# Altium schematic sheet Sheet1.SchDoc
size A4; SheetNumber: 1; SheetTotal: 1
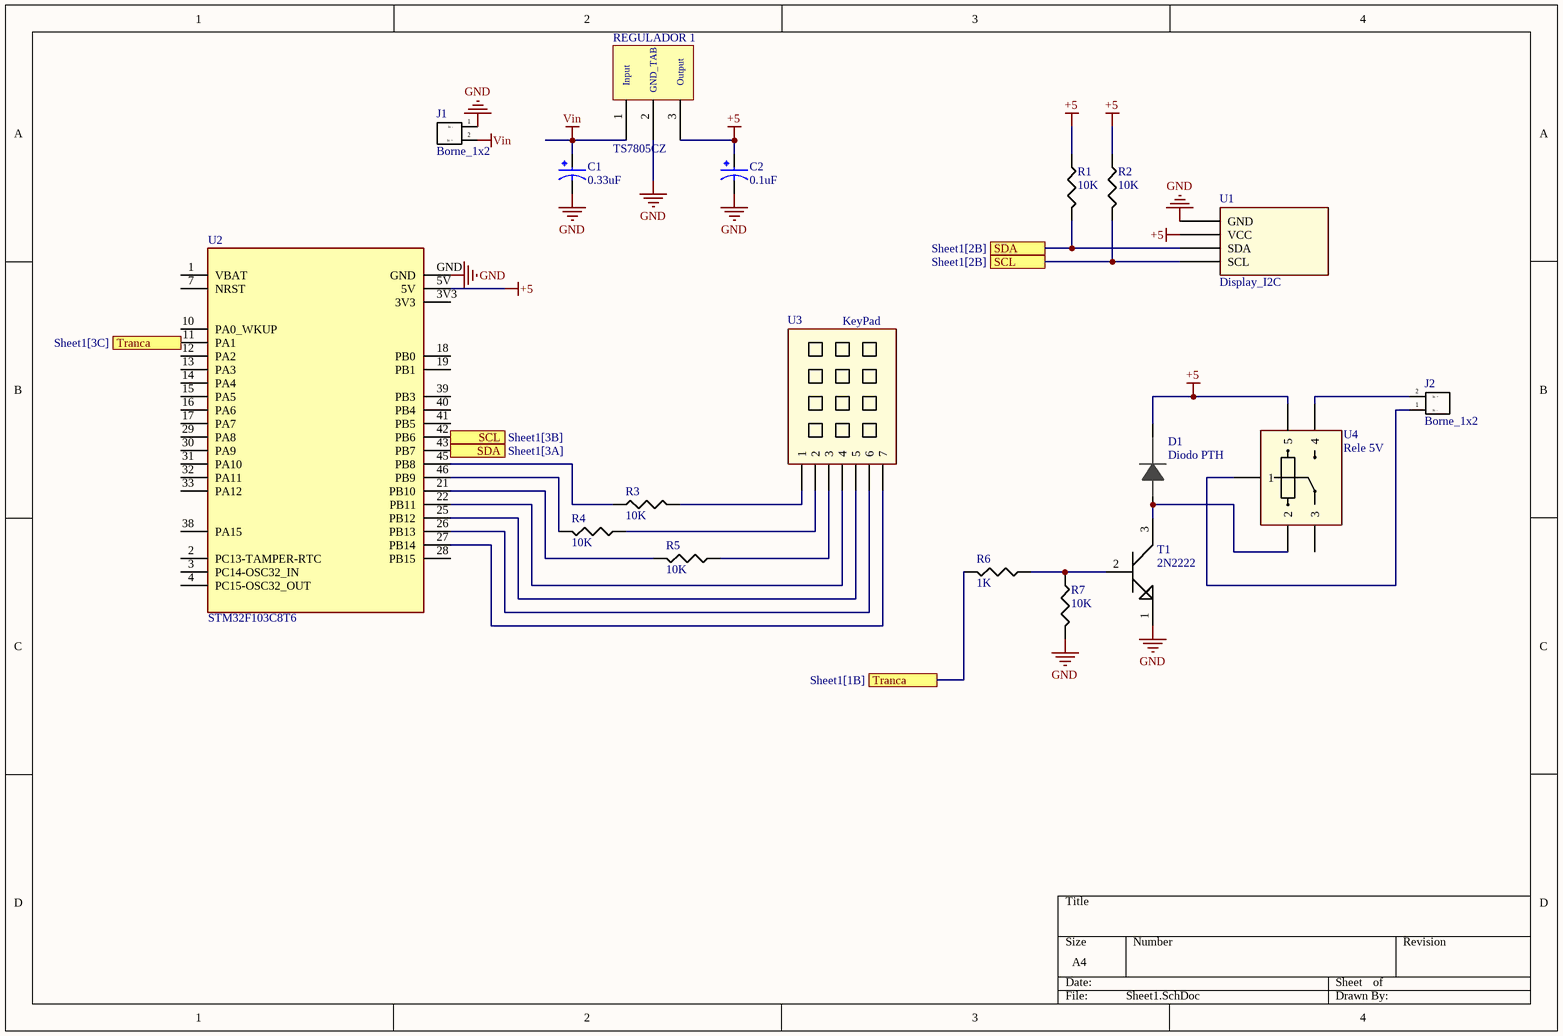
[diagram p0: Sheet1.SchDoc]

## Parts
C1  0.33uF  [CAPPRD250W45D630H700]
C2  0.1uF  [CAPPRD250W45D630H700]
D1  Diodo PTH  [DIODO]
J1  Borne_1x2  [Borne1x2]
J2  Borne_1x2  [Borne1x2]
R1  10K  [R_PTH]
R2  10K  [R_PTH]
R3  10K  [R_PTH]
R4  10K  [R_PTH]
R5  10K  [R_PTH]
R6  1K  [R_PTH]
R7  10K  [R_PTH]
REGULADOR_1  TS7805CZ  [TS7805CZ-TO220]
T1  2N2222  [2N2222]
U1  Display_I2C  [LCD_I2C]
U2  STM32F103C8T6  [STM32]
U3  KeyPad  [KeyPad]
U4  Rele 5V  [Rele]

## Ports
SCL (see Sheet1[2B]), SCL (see Sheet1[3B]), SDA (see Sheet1[2B]), SDA (see Sheet1[3A]), Tranca (see Sheet1[1B]), Tranca (see Sheet1[3C])

## Nets
+5: C2.P D1.1 R1.1 R2.1 REGULADOR_1.3 U1.2(VCC) U2.5V U4.5
GND: C1.N C2.N J1.1(In_-) R7.2 REGULADOR_1.2 T1.1 U1.1(GND) U2.GND
Vin: C1.P J1.2(In_+) REGULADOR_1.1
SCL: R2.2 U1.4(SCL) U2.42(PB6) ; port SCL
SDA: R1.2 U1.3(SDA) U2.43(PB7) ; port SDA
Tranca: R6.2 U2.11(PA1) ; port Tranca
NetD1_2: D1.2 T1.3 U4.2
NetJ2_1: J2.1(In_-) U4.1
NetJ2_2: J2.2(In_+) U4.4
NetR3_1: R3.1 U2.45(PB8)
NetR3_2: R3.2 U3.1
NetR4_1: R4.1 U3.2
NetR4_2: R4.2 U2.46(PB9)
NetR5_1: R5.1 U3.3
NetR5_2: R5.2 U2.21(PB10)
NetR6_1: R6.1 R7.1 T1.2
NetU2_22: U2.22(PB11) U3.4
NetU2_25: U2.25(PB12) U3.5
NetU2_26: U2.26(PB13) U3.6
NetU2_27: U2.27(PB14) U3.7

Not connected (* = marked no-connect by the designer): U2 1(VBAT) 2(PC13-TAMPER-RTC) 3(PC14-OSC32_IN) 3V3 4(PC15-OSC32_OUT) 7(NRST) 10(PA0_WKUP) 12(PA2) 13(PA3) 14(PA4) 15(PA5) 16(PA6) 17(PA7) 18(PB0) 19(PB1) 28(PB15) 29(PA8) 30(PA9) 31(PA10) 32(PA11) 33(PA12) 38(PA15) 39(PB3) 40(PB4) 41(PB5); U4 3

## Notes on the sheet
- (in symbol TS7805CZ) Input; Output; GND_TAB

## Library data of the parts
C1 C2 = EEAGA1A680: Aluminium Electrolytic Capacitor, Ga Series, 68 - F, - 20%, 10 V, 6.3 Mm, Radial Leaded; MF: Panasonic; Value: *; Price: None; Package: RADIAL-2 Panasonic; Availability: In Stock; Check_prices: https://www.snapeda.com/parts/EEAGA1A680/Panasonic/view-part/2776310/?ref=eda; MP: EEAGA1A680; SnapEDA_Link: https://www.snapeda.com/parts/EEAGA1A680/Panasonic/view-part/2776310/?ref=snap
D1 = Diodo
R1-R7 = R_PTH_10k
REGULADOR_1 = TS7805CZ: Linear Voltage Regulator, Fixed, Positive Output, 35 V, 5 V, 1.5 A, 3 Pins, TO-220; Manufacturer: STMicroelectronics; Manufacturer Part Number: L7805CV; Dropout Voltage: 2V; Max Supply Voltage: 25V; Max Junction Temperature (Tj): 125°C; Max Output current: 1.5A; Min Input Voltage: 7V; Min Output Voltage: 4.65V; Nominal Output Voltage: 5V; Number of Channels: 1; Power Supply Rejection Ratio (PSRR): 62dB; Quiescent Current: 8mA; Tolerance: 5%; Supplier: Avnet; Supplier Part Number: L7805CV; RoHS: Compliant; Category: Voltage Regulators - Linear; Stock: 15085; Pricing: 1=0,41797, 2=0,2691, 4=0,26772, 8=0,26634, 16=0,16896 (USD); Case/Package: TO-220; China RoHS: Non-Compliant; Contact Plating: Gold; Height: 9.15mm; Height - Seated (Max): 19.68mm; Lead Free: Lead Free; Length: 10.2mm; Lifecycle Status: Production; Max Operating Temperature: 125°C; Min Operating Temperature: -40°C; Mounting Technology: Through Hole; Number of Circuits: 1; Number of Outputs: 1; Pins: 3; Number of Regulators: 1; Number of Terminals: 3; Output Current: 1.5A; Output Type: Fixed; Output Voltage: 5V; Polarity: Positive; Radiation Hardening: No; REACH SVHC: No; Schedule B: 8542390000, 8542390000|8542390000|8542390000|8542390000|8542390000|8542390000|8542390000|8542390000|8542390000|8542390000|8542390000|8542390000|8542390000|8542390000|8542390000|8542390000|8542390000|8542390000|8542390000|8542390000|8542390000, 8542390000|8542390000|8542390000|8542390000|8542390000|8542390000|8542390000|8542390000|8542390000|8542390000|8542390000|8542390000|8542390000|8542390000|8542390000|8542390000|8542390000|8542390000|8542390000|8542390000|8542390000|8542390000, 8542390000|8542390000|8542390000|8542390000|8542390000|8542390000|8542390000|8542390000|8542390000|8542390000|8542390000|8542390000|8542390000|8542390000|8542390000|8542390000|8542390000|8542390000|8542390000|8542390000|8542390000|8542390000|8542390000; Terminal Pitch: 2.54mm; Voltage Tolerance: 5%; Weight: 2.299997g; Width: 4.5mm; ComponentLink1URL: https://datasheet.octopart.com:443/L7805CV-STMicroelectronics-datasheet-136036604.pdf?src-supplier=ODG+(Origin+Data+Global); ComponentLink1Description: https://datasheet.octopart.com:443/L7805CV-STMicroelectronics-datasheet-136036604.pdf?src-supplier=ODG+(Origin+Data+Global); ComponentLink2URL: https://datasheet.octopart.com:443/L7805CV-STMicroelectronics-datasheet-73860655.pdf?src-supplier=Farnell; ComponentLink2Description: https://datasheet.octopart.com:443/L7805CV-STMicroelectronics-datasheet-73860655.pdf?src-supplier=Farnell; ComponentLink3URL: https://datasheet.octopart.com:443/L7805CV-STMicroelectronics-datasheet-14717135.pdf?src-supplier=Farnell; ComponentLink3Description: https://datasheet.octopart.com:443/L7805CV-STMicroelectronics-datasheet-14717135.pdf?src-supplier=Farnell; ComponentLink4URL: https://datasheet.octopart.com:443/L7805CV-STMicroelectronics-datasheet-108470.pdf?src-supplier=Farnell; ComponentLink4Description: https://datasheet.octopart.com:443/L7805CV-STMicroelectronics-datasheet-108470.pdf?src-supplier=Farnell; ComponentLink5URL: https://datasheet.octopart.com:443/L7805CV-STMicroelectronics-datasheet-25360458.pdf?src-supplier=element14+APAC; ComponentLink5Description: https://datasheet.octopart.com:443/L7805CV-STMicroelectronics-datasheet-25360458.pdf?src-supplier=element14+APAC; ComponentLink6URL: https://datasheet.octopart.com:443/L7805CV-STMicroelectronics-datasheet-62333080.pdf?src-supplier=element14+APAC; ComponentLink6Description: https://datasheet.octopart.com:443/L7805CV-STMicroelectronics-datasheet-62333080.pdf?src-supplier=element14+APAC; ComponentLink7URL: https://datasheet.octopart.com:443/L7805CV-STMicroelectronics-datasheet-5316848.pdf?src-supplier=Factory+Futures; ComponentLink7Description: https://datasheet.octopart.com:443/L7805CV-STMicroelectronics-datasheet-5316848.pdf?src-supplier=Factory+Futures; ComponentLink8URL: https://datasheet.octopart.com:443/L7805CV-STMicroelectronics-datasheet-11003276.pdf?src-supplier=Factory+Futures; ComponentLink8Description: https://datasheet.octopart.com:443/L7805CV-STMicroelectronics-datasheet-11003276.pdf?src-supplier=Factory+Futures; ComponentLink9URL: https://datasheet.octopart.com:443/L7805CV-STMicroelectronics-datasheet-12510217.pdf?src-supplier=Factory+Futures; ComponentLink9Description: https://datasheet.octopart.com:443/L7805CV-STMicroelectronics-datasheet-12510217.pdf?src-supplier=Factory+Futures; ComponentLink10URL: https://datasheet.octopart.com:443/L7805CV-STMicroelectronics-datasheet-10835933.pdf?src-supplier=Factory+Futures; ComponentLink10Description: https://datasheet.octopart.com:443/L7805CV-STMicroelectronics-datasheet-10835933.pdf?src-supplier=Factory+Futures; ComponentLink11URL: https://datasheet.octopart.com:443/L7805CV-STMicroelectronics-datasheet-10550045.pdf?src-supplier=Factory+Futures; ComponentLink11Description: https://datasheet.octopart.com:443/L7805CV-STMicroelectronics-datasheet-10550045.pdf?src-supplier=Factory+Futures; ComponentLink12URL: https://datasheet.octopart.com:443/L7805CV-STMicroelectronics-datasheet-10406743.pdf?src-supplier=Factory+Futures; ComponentLink12Description: https://datasheet.octopart.com:443/L7805CV-STMicroelectronics-datasheet-10406743.pdf?src-supplier=Factory+Futures; ComponentLink13URL: https://datasheet.octopart.com:443/L7805CV-STMicroelectronics-datasheet-10082731.pdf?src-supplier=Factory+Futures; ComponentLink13Description: https://datasheet.octopart.com:443/L7805CV-STMicroelectronics-datasheet-10082731.pdf?src-supplier=Factory+Futures; ComponentLink14URL: https://datasheet.octopart.com:443/L7805CV-STMicroelectronics-datasheet-180738849.pdf?src-supplier=IHS; ComponentLink14Description: https://datasheet.octopart.com:443/L7805CV-STMicroelectronics-datasheet-180738849.pdf?src-supplier=IHS; ComponentLink15URL: https://datasheet.octopart.com:443/L7805CV-STMicroelectronics-datasheet-62333152.pdf?src-supplier=STMicroelectronics; ComponentLink15Description: https://datasheet.octopart.com:443/L7805CV-STMicroelectronics-datasheet-62333152.pdf?src-supplier=STMicroelectronics; ComponentLink16URL: https://datasheet.octopart.com:443/L7805C-V-STMicroelectronics-datasheet-8494008.pdf?src-supplier=Future+Electronics; ComponentLink16Description: https://datasheet.octopart.com:443/L7805C-V-STMicroelectronics-datasheet-8494008.pdf?src-supplier=Future+Electronics; ComponentLink17URL: https://datasheet.octopart.com:443/L7805CV-STMicroelectronics-datasheet-8464528.pdf?src-supplier=Future+Electronics; ComponentLink17Description: https://datasheet.octopart.com:443/L7805CV-STMicroelectronics-datasheet-8464528.pdf?src-supplier=Future+Electronics; ComponentLink18URL: https://datasheet.octopart.com:443/L7805CV-STMicroelectronics-datasheet-109553.pdf?src-supplier=element14; ComponentLink18Description: https://datasheet.octopart.com:443/L7805CV-STMicroelectronics-datasheet-109553.pdf?src-supplier=element14; ComponentLink19URL: https://datasheet.octopart.com:443/L7805CV-STMicroelectronics-datasheet-5578.pdf?src-supplier=Newark; ComponentLink19Description: https://datasheet.octopart.com:443/L7805CV-STMicroelectronics-datasheet-5578.pdf?src-supplier=Newark; ComponentLink20URL: https://datasheet.octopart.com:443/L7805CV-STMicroelectronics-datasheet-61038.pdf?src-supplier=SOS+electronic; ComponentLink20Description: https://datasheet.octopart.com:443/L7805CV-STMicroelectronics-datasheet-61038.pdf?src-supplier=SOS+electronic; ComponentLink21URL: https://datasheet.octopart.com:443/L7805CV-STMicroelectronics-datasheet-14169698.pdf?src-supplier=iiiC; ComponentLink21Description: https://datasheet.octopart.com:443/L7805CV-STMicroelectronics-datasheet-14169698.pdf?src-supplier=iiiC; ComponentLink22URL: https://datasheet.octopart.com:443/L7805CV-STMicroelectronics-datasheet-11554490.pdf?src-supplier=Arrow+Electronics; ComponentLink22Description: https://datasheet.octopart.com:443/L7805CV-STMicroelectronics-datasheet-11554490.pdf?src-supplier=Arrow+Electronics; ComponentLink23URL: https://datasheet.octopart.com:443/L7805CV-STMicroelectronics-datasheet-9642343.pdf?src-supplier=RS+(Formerly+Allied+Electronics); ComponentLink23Description: https://datasheet.octopart.com:443/L7805CV-STMicroelectronics-datasheet-9642343.pdf?src-supplier=RS+(Formerly+Allied+Electronics); ComponentLink24URL: https://datasheet.octopart.com:443/L7805CV-STMicroelectronics-datasheet-7264666.pdf?src-supplier=Jameco; ComponentLink24Description: https://datasheet.octopart.com:443/L7805CV-STMicroelectronics-datasheet-7264666.pdf?src-supplier=Jameco; ComponentLink25URL: https://datasheet.octopart.com:443/L7805CV-STMicroelectronics-datasheet-154404753.pdf?src-supplier=Jameco; ComponentLink25Description: https://datasheet.octopart.com:443/L7805CV-STMicroelectronics-datasheet-154404753.pdf?src-supplier=Jameco
U2 = STM32F103C8T6: ARM® Cortex®-M3 STM32F1 Microcontroller IC 32-Bit 72MHz 64KB (64K x 8) FLASH 48-LQFP (7x7); MF: STMicroelectronics; SnapEDA_Link: https://www.snapeda.com/parts/STM32F103C8T6/STMicroelectronics/view-part/?ref=snap; Package: LQFP-48 STMicroelectronics; Value: *; MP: STM32F103C8T6; Check_prices: https://www.snapeda.com/parts/STM32F103C8T6/STMicroelectronics/view-part/?ref=eda
U4 = Rele